# Altium schematic sheet Sheet2.SchDoc
size A4; SheetNumber: 2; SheetTotal: 2
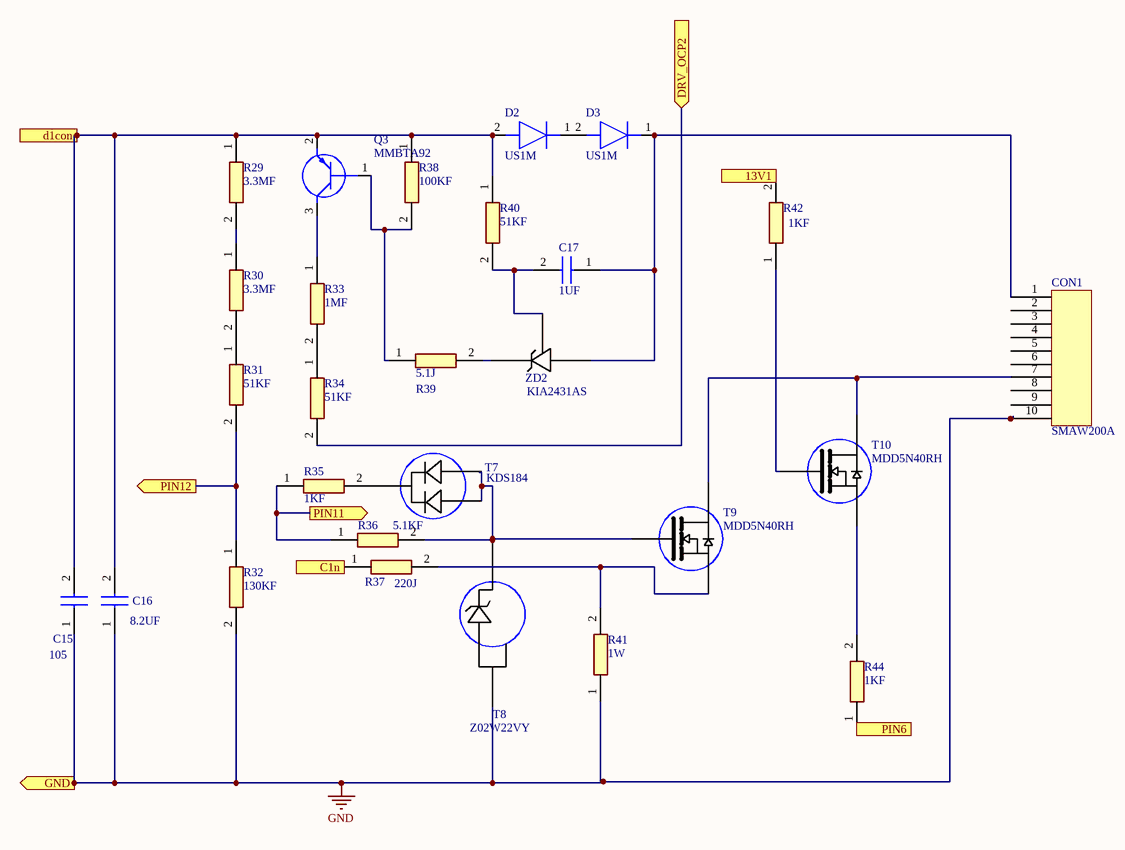
[diagram p0: Sheet2.SchDoc]

## Parts
C15  105  [CAPPRD200W55D525H1200]
C16  8.2UF  [CAPPRD200W55D525H1200]
C17  1UF  [CAPPRD200W55D525H1200]
CON1  SMAW200A  [SMAW200A]
D2  US1M  [DIOM5127X229N]
D3  US1M  [DIOM5127X229N]
Q3  MMBTA92  [SOT95P245X130-3N]
R29  3.3MF  [RESAD1170W45L370D200]
R30  3.3MF  [RESAD1170W45L370D200]
R31  51KF  [RESAD1170W45L370D200]
R32  130KF  [RESAD1170W45L370D200]
R33  1MF  [RESAD1170W45L370D200]
R34  51KF  [RESAD1170W45L370D200]
R35  1KF  [RESAD1170W45L370D200]
R36  5.1KF  [RESAD1170W45L370D200]
R37  220J  [RESAD1170W45L370D200]
R38  100KF  [RESAD1170W45L370D200]
R39  5.1J  [RESAD1170W45L370D200]
R40  51KF  [RESAD1170W45L370D200]
R41  1W  [RESAD1170W45L370D200]
R42  1KF  [RESAD1170W45L370D200]
R44  1KF  [RESAD1170W45L370D200]
T7  KDS184
T8  Z02W22VY
T9  MDD5N40RH
T10  MDD5N40RH
ZD2  KIA2431AS  [KIA2431AS]

## Ports
13V1 (in, see Sheet1[1A], Sheet1[1C]), C1n (out, see Sheet1[4C]), d1con (out, see Sheet1[4B]), DRV_OCP2 (in, see Sheet1[1A]), GND (out, see Sheet1[4D]), PIN6 (out, see Sheet1[1C]), PIN11 (out, see Sheet1[2C]), PIN12 (out, see Sheet1[2C])

## Nets
GND: C15.1(+) C16.1(+) CON1.10 R32.2 R41.1 T8.2 ; port GND
13V1: R42.2 ; port 13V1
C1n: R37.1 ; port C1n
d1con: C15.2(-) C16.2(-) D2.2(A) Q3.2(E) R29.1 R38.1 R40.1 ; port d1con
DRV_OCP2: R34.2 ; port DRV_OCP2
PIN6: R44.1 ; port PIN6
PIN11: R35.1 R36.1 ; port PIN11
PIN12: R31.2 R32.1 ; port PIN12
NetC17_1: C17.1(+) CON1.1 D3.1(K) ZD2.2
NetC17_2: C17.2(-) R40.2 ZD2.3
NetCON1_7: CON1.7 T9.70 T10.70
NetD2_1: D2.1(K) D3.2(A)
NetQ3_1: Q3.1(B) R38.2 R39.1
NetQ3_3: Q3.3(C) R33.1
NetR29_2: R29.2 R30.1
NetR30_2: R30.2 R31.1
NetR33_2: R33.2 R34.1
NetR35_2: R35.2 T7.3
NetR36_2: R36.2 T7.2 T8.1 T9.72
NetR37_2: R37.2 R41.2 T9.71
NetR39_2: R39.2 ZD2.1
NetR42_1: R42.1 T10.72
NetR44_2: R44.2 T10.71

Not connected (* = marked no-connect by the designer): CON1 2(70) 3(71) 4(72) 5(73) 6(74) 8(76) 9(77); T7 1(25)

## Library data of the parts
C15-C17 = ECA-1HM0R1: Capacitor; Manufacturer_Name: Panasonic; Height: 12mm; Manufacturer_Part_Number: ECA-1HM0R1; Mouser Part Number: 667-ECA-1HM0R1; Mouser Price/Stock: https://www.mouser.com/Search/Refine.aspx?Keyword=667-ECA-1HM0R1
D2 D3 = US1M-E3_61T: Diode; Manufacturer_Name: Vishay; Manufacturer_Part_Number: US1M-E3/61T; Datasheet Link: https://componentsearchengine.com/Datasheets/2/US1M-E3_61T.pdf; Height: 2.29mm; Mouser Part Number: 625-US1M-E3; Mouser Price/Stock: https://www.mouser.co.uk/ProductDetail/Vishay-General-Semiconductor/US1M-E3-61T?qs=D6r9GjgEnNOosWuyVR8q1A%3D%3D; Arrow Part Number: US1M-E3/61T; Arrow Price/Stock: https://www.arrow.com/en/products/us1m-e361t/vishay?region=europe
Q3 = MMBTA92: Transistor BJT PNP; Manufacturer_Name: KEC; Datasheet Link: https://www.alldatasheet.com/datasheet-pdf/pdf/69996/KEC/MMBTA92.html; Height: 1.3mm; Manufacturer_Part_Number: MMBTA92
R29-R42 R44 = MFR3-10KFC: Resistor; Manufacturer_Name: TT Electronics; Datasheet Link: https://componentsearchengine.com/Datasheets/2/MFR3-10KFC.pdf; Manufacturer_Part_Number: MFR3-10KFC; Mouser Part Number: 756-MFR3-10KFC; Mouser Price/Stock: https://www.mouser.co.uk/ProductDetail/Welwyn-Components-TT-Electronics/MFR3-10KFC?qs=i9QNUsDsAPN%252BMi4lKUEV5Q%3D%3D; Arrow Part Number: MFR3-10KFC; Arrow Price/Stock: https://www.arrow.com/en/products/mfr3-10kfc/welwyn-components?region=europe